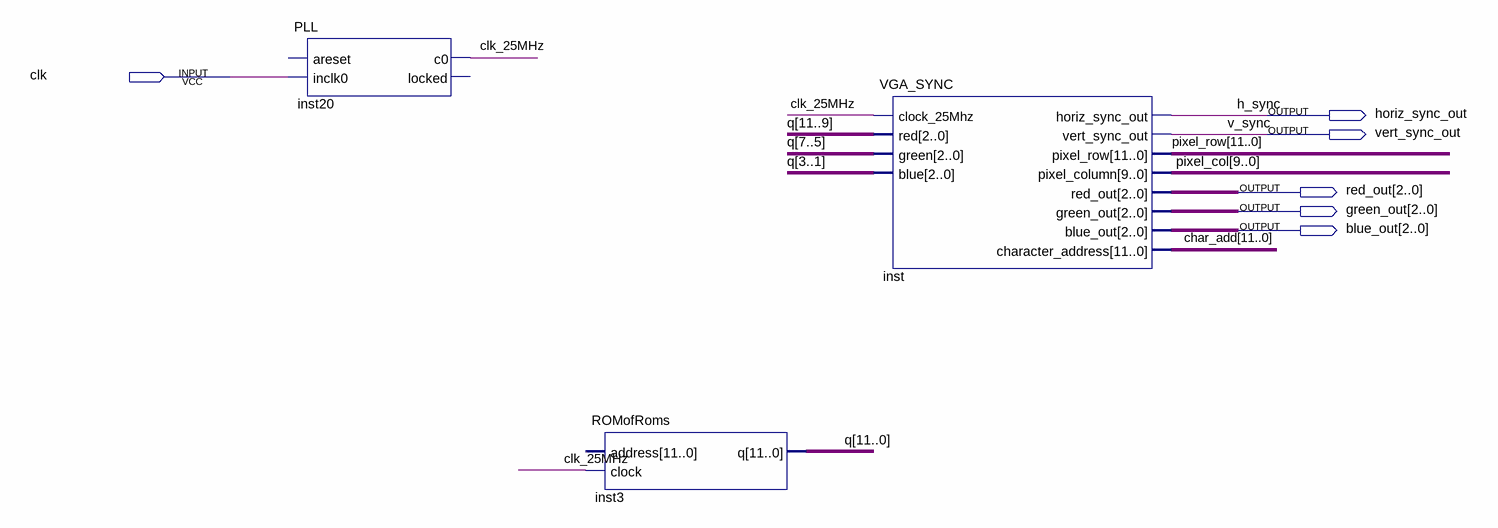
[diagram p0: schematic sheet]
// Quartus schematic image.bdf as structural Verilog: 3 symbols, 6 pins
module image (
  input  clk,
  output horiz_sync_out,
  output vert_sync_out,
  output [2:0] red_out,
  output [2:0] green_out,
  output [2:0] blue_out
);

  wire clk_25MHz;
  wire [9:0] pixel_col;
  wire [11:0] char_add, pixel_row, q;

  PLL inst20 (.inclk0(clk), .c0(clk_25MHz));  // open: areset, locked
  ROMofRoms inst3 (.clock(clk_25MHz), .q(q));  // open: address
  VGA_SYNC inst (
    .clock_25Mhz(clk_25MHz), .red(q[11:9]), .green(q[7:5]), .blue(q[3:1]), .horiz_sync_out(horiz_sync_out),
    .vert_sync_out(vert_sync_out), .pixel_row(pixel_row), .pixel_column(pixel_col), .red_out(red_out),
    .green_out(green_out), .blue_out(blue_out), .character_address(char_add));

  // Other names for the same wires on the sheet: h_sync = horiz_sync_out; v_sync = vert_sync_out
endmodule
